# EAGLE design ModuleGliderScore (EAGLE 7.5.0)
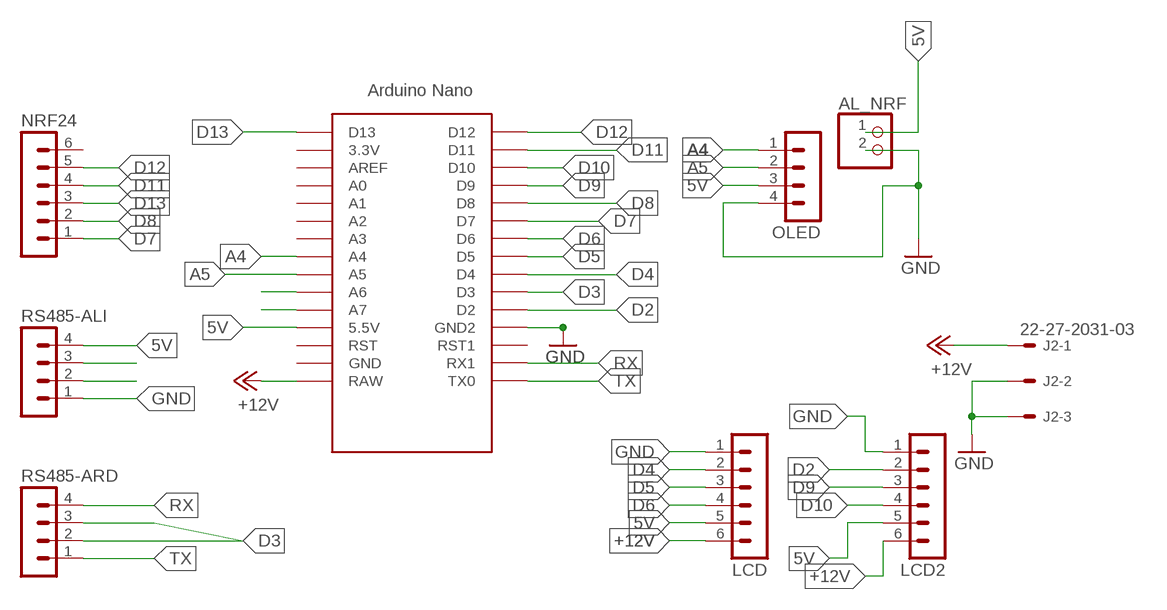
[diagram p0: schematic, sheet 1]

## Parts
AL_NRF  PINHD-1X2  [1X02]
J2  22-27-2031-03  [6410-03]
LCD  MA06-1  [MA06-1]
LCD2  MA06-1  [MA06-1]
NRF24  MA06-1  [MA06-1]
OLED  MA04-1  [MA04-1]
RS485-ALI  MA04-1  [MA04-1]
RS485-ARD  MA04-1  [MA04-1]
U$1  NANO  [NANO]

## Nets
5V: AL_NRF.1 LCD2.5 LCD.5 OLED.3 RS485-ALI.4 U$1.5V(5.5V)
+12V: J2.1 LCD2.6 LCD.6 U$1.RAW
A4: OLED.1 U$1.A4
A5: OLED.2 U$1.A5
A6-D: U$1.A6
A7-D: U$1.A7
D2: LCD2.2 U$1.D2
D3: RS485-ARD.2 RS485-ARD.3 U$1.D3
D4: LCD.2 U$1.D4
D5: LCD.3 U$1.D5
D6: LCD.4 U$1.D6
D7: NRF24.1 U$1.D7
D8: NRF24.2 U$1.D8
D9: LCD2.3 U$1.D9
D10: LCD2.4 U$1.D10
D11: NRF24.4 U$1.D11
D12: NRF24.5 U$1.D12
D13: NRF24.3 U$1.D13
GND: AL_NRF.2 J2.2 J2.3 LCD2.1 LCD.1 OLED.4 RS485-ALI.1 U$1.GND1(GND2)
N$8: RS485-ALI.2
N$9: RS485-ALI.3
RX: RS485-ARD.4 U$1.RX1
TX: RS485-ARD.1 U$1.TX0
Unconnected: NRF24.6 U$1.3.3V U$1.A0 U$1.A1 U$1.A2 U$1.A3 U$1.AREF U$1.GND U$1.ICSP1 U$1.ICSP2 U$1.ICSP3 U$1.ICSP4 U$1.ICSP5 U$1.ICSP6 U$1.RST U$1.RST1

## Library data of the parts
AL_NRF = pinhead:PINHD-1X2: PIN HEADER
J2 = con-molex:22-?-03: CONNECTOR wire to board 2.54 mm (.1 inch) pitch header; OC_FARNELL: unknown; OC_NEWARK: unknown
LCD LCD2 NRF24 = con-lstb:MA06-1: PIN HEADER; OC_FARNELL: unknown; OC_NEWARK: unknown
OLED RS485-ALI RS485-ARD = con-lstb:MA04-1: PIN HEADER; OC_FARNELL: unknown; OC_NEWARK: unknown
U$1 = Arduino-clone:NANO: Arduino Nano

## Board
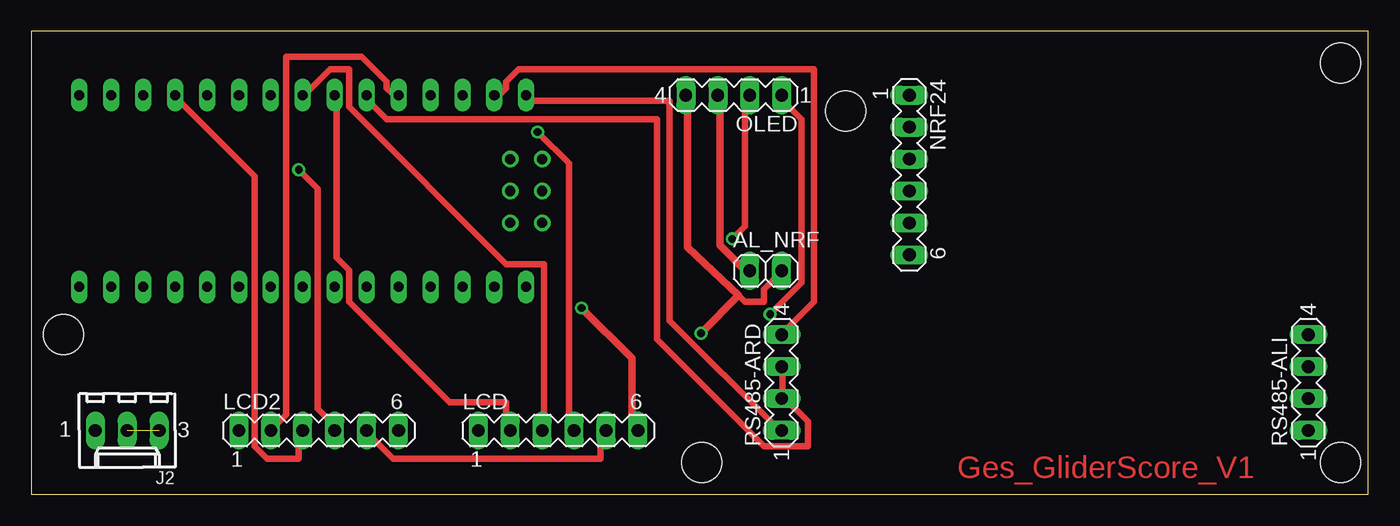
[diagram p1: board, top side]
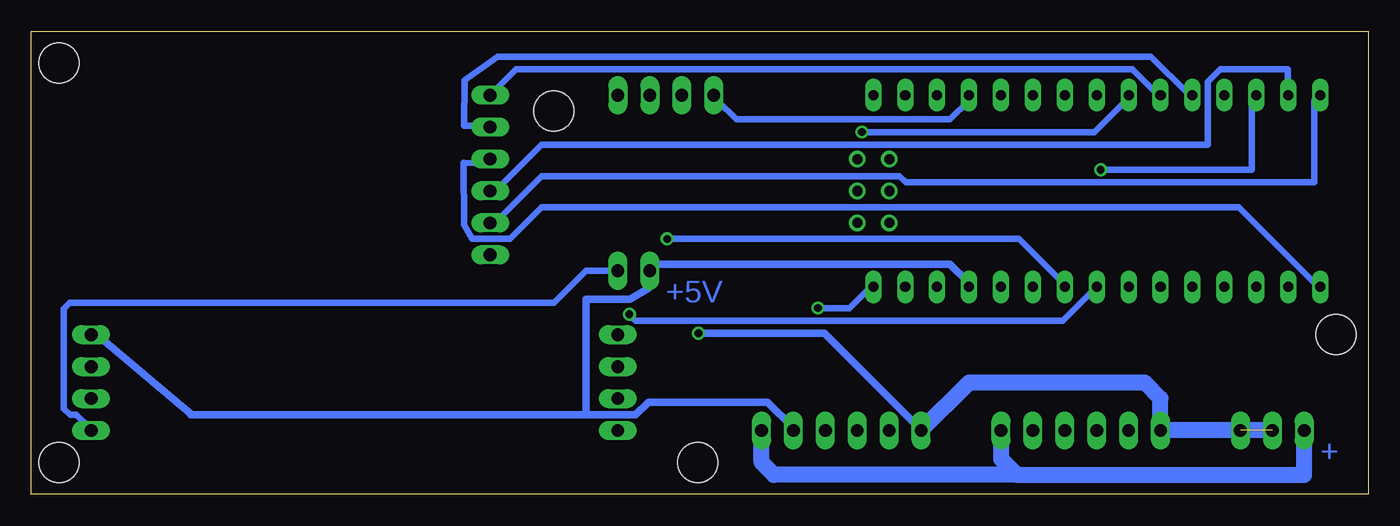
[diagram p2: board, bottom side, seen from below]

Size 106.35 x 36.82 mm. Coordinates in mm from the lower left corner, seen from the top.
Outline: 0,0 106.35,0 106.35,36.82 0,36.82 0,0
Copper layers (1*16): Top 0.035mm / dielectric 1.5mm / Bottom 0.035mm
Design rules "default *": minimum track width 20mil, minimum drill 24mil, track to track 8mil, track to pad 8mil, pad to pad 8mil, via to via 8mil, smd to smd 8mil, copper to edge 40mil, drill to drill 8mil, minimum pad ring 10mil, minimum via ring 8mil, stop-mask expansion 4mil, vias tented up to drill 0mil, thermal gap 10mil
Holes 3.2 mm at 104.14,34.29 104.14,2.54 2.54,12.7 53.34,2.54 64.77,30.48

### Footprints (pad centres in the part's own frame; a part is rotated, then mirrored left to right if it is on the bottom)
1X02 = drill 1.016 long: 1 -1.27,0; 2 1.27,0
6410-03 = drill 1.016 long: 1 2.54,0; 2 0,0; 3 -2.54,0
MA06-1 = drill 1.016 long: 1 -6.35,0; 2 -3.81,0; 3 -1.27,0; 4 1.27,0; 5 3.81,0; 6 6.35,0
MA04-1 = drill 1.016 long: 1 -3.81,0; 2 -1.27,0; 3 1.27,0; 4 3.81,0
NANO = drill 0.8 long: 3.3V -10.16,24.13; 5V -10.16,-1.27; A0 -10.16,19.05; A1 -10.16,16.51; A2 -10.16,13.97; A3 -10.16,11.43; A4 -10.16,8.89; A5 -10.16,6.35; A6 -10.16,3.81; A7 -10.16,1.27; AREF -10.16,21.59; D2 5.08,1.27; D3 5.08,3.81; D4 5.08,6.35; D5 5.08,8.89; D6 5.08,11.43; D7 5.08,13.97; D8 5.08,16.51; D9 5.08,19.05; D10 5.08,21.59; D11 5.08,24.13; D12 5.08,26.67; D13 -10.16,26.67; GND -10.16,-6.35; GND1 5.08,-1.27; RAW -10.16,-8.89; RST -10.16,-3.81; RST1 5.08,-3.81; RX1 5.08,-6.35; TX0 5.08,-8.89 | drill 0.8: ICSP1 -5.08,-10.16; ICSP2 -5.08,-7.62; ICSP3 -2.54,-10.16; ICSP4 -2.54,-7.62; ICSP5 0,-10.16; ICSP6 0,-7.62

### Placement (x,y rotation side)
AL_NRF  58.42,17.78 0 top
J2  7.62,5.08 180 top
LCD  41.91,5.08 0 top
LCD2  22.86,5.08 0 top
NRF24  69.85,25.4 270 top
OLED  55.88,31.75 180 top
RS485-ALI  101.6,8.89 90 top
RS485-ARD  59.69,8.89 90 top
U$1  30.48,26.67 90 top

### Tracks (layer width: path | path; a pad name or v marks a point on that pad's centre or on a via)
5V
  Top 0.508: LCD2.5 26.77,4.82 28.77,2.82 45.27,2.82 45.27,4.82 LCD.5 | 54.77,31.32 OLED.3 | 56.77,17.82 AL_NRF.1
  Top 0.61: 54.77,31.32 54.77,19.82 56.77,17.82
  Bottom 0.406: 93.69,6.32 93.69,6.43
  Bottom 0.508: 31.77,16.82 U$1.5V | 57.27,17.82 AL_NRF.1 | 101.27,12.82 RS485-ALI.4 | 45.77,5.32 LCD.5
  Bottom 0.61: 31.77,16.82 33.27,18.32 56.77,18.32 57.27,17.82 | 93.69,6.43 101.27,12.82 | AL_NRF.1 57.27,17.32 57.27,16.39 58.7,15.51 62.21,15.52 62.23,6.32 | 45.77,5.32 47.77,7.32 57.27,7.32 58.27,6.32 62.23,6.32 | 62.23,6.32 93.69,6.32
+12V  (via drill 0.61)
  Top 0.508: 47.77,5.32 LCD.6
  Top 0.61: v43.77,14.82 47.77,10.82 47.77,5.32
  Bottom 0.508: v43.77,14.82 41.27,14.82 39.77,16.32 U$1.RAW | 29.27,4.82 LCD2.6
  Bottom 1.27: 27.94,1.55 47.27,1.55 48.26,2.54 LCD.6 | LCD2.6 29.21,2.82 27.94,1.55 | J2.1 5.08,1.55 27.94,1.55
A4  (via drill 0.61)
  Top 0.508: v58.77,14.32 61.27,16.82 61.27,29.82 59.77,31.32 OLED.1
  Bottom 0.508: v58.77,14.32 58.27,13.82 24.27,13.82 21.77,16.32 U$1.A4
A5  (via drill 0.61)
  Top 0.508: v55.77,20.32 56.77,21.32 56.77,31.32 OLED.2
  Bottom 0.508: v55.77,20.32 27.77,20.32 24.27,16.82 U$1.A5
D2
  Top 0.508: U$1.D2 28.77,31.82 28.27,32.32 28.27,32.82 26.27,34.82 20.27,34.82 20.27,6.32 19.27,5.32 LCD2.2
D3
  Top 0.508: 59.77,7.82 61.77,5.82 61.77,3.82 58.27,3.82 49.77,12.32 49.77,29.82 28.27,29.82 26.77,31.32 U$1.D3 | 59.77,7.82 59.77,9.82 RS485-ARD.3 | 59.77,7.82 RS485-ARD.2
D4
  Top 0.508: U$1.D4 24.27,31.32 24.27,18.82 25.27,17.82 25.27,15.32 33.27,7.32 37.77,7.32 37.77,5.32 LCD.2
D5
  Top 0.508: U$1.D5 21.77,31.82 23.77,33.82 25.27,33.82 25.27,30.82 37.77,18.32 40.77,18.32 40.77,5.32 LCD.3
D6  (via drill 0.61)
  Top 0.508: v40.27,28.82 42.77,26.32 42.77,5.32 LCD.4
  Bottom 0.508: v40.27,28.82 21.77,28.82 19.27,31.32 U$1.D6
D7
  Bottom 0.508: U$1.D7 16.77,31.82 18.77,33.82 67.77,33.82 69.77,31.82 NRF24.1
D8
  Bottom 0.508: U$1.D8 14.27,31.82 17.27,34.82 69.27,34.82 71.9,32.95 71.94,29.32 70.27,29.32 NRF24.2
D9
  Top 0.508: U$1.D9 11.77,31.32 17.77,25.32 17.77,3.82 18.77,2.82 21.27,2.82 21.27,4.82 LCD2.3
D10  (via drill 0.61)
  Top 0.508: v21.27,25.82 22.77,24.32 22.77,6.82 23.77,5.82 23.77,5.32 LCD2.4
  Bottom 0.508: v21.27,25.82 9.27,25.82 9.27,31.32 U$1.D10
D11
  Bottom 0.508: U$1.D11 6.4,31.82 6.4,33.82 11.77,33.82 12.77,32.82 12.77,27.82 65.77,27.82 69.27,24.32 69.77,24.32 NRF24.4
D12
  Bottom 0.508: U$1.D12 4.27,31.32 4.27,24.82 36.77,24.82 37.27,25.32 65.77,25.32 69.27,21.82 69.77,21.82 NRF24.5
D13
  Bottom 0.508: U$1.D13 4.27,16.82 10.27,22.82 65.77,22.82 68.27,20.32 71.27,20.32 71.94,21.45 71.98,26.36 70.27,26.32 NRF24.3
GND  (via drill 0.61)  (1 unrouted)
  Top 0.508: 56.27,15.82 56.77,15.32 58.27,15.32 58.27,16.32 59.27,17.32 AL_NRF.2
  Top 0.61: v53.27,12.82 56.27,15.82 52.21,19.64 52.21,31.61 OLED.4
  Bottom 0.508: U$1.GND1 31.77,31.32 33.27,29.82 50.27,29.82 51.77,31.32 OLED.4 | RS485-ALI.1 101.77,5.32 102.77,6.32 103.27,6.32 103.77,6.82 103.77,14.78 103.31,15.24 64.77,15.24 62.23,17.78 AL_NRF.2 | 35.77,5.32 LCD.1
  Bottom 0.61: 35.77,5.32 43.27,12.82 v53.27,12.82
  Bottom 1.27: LCD.1 31.75,8.89 17.78,8.89 16.51,7.62 LCD2.1 J2.2
RX
  Top 0.508: U$1.RX1 37.27,31.82 37.77,32.32 37.77,32.82 38.77,33.82 62.27,33.82 62.27,15.32 59.77,12.82 RS485-ARD.4
TX
  Top 0.508: U$1.TX0 39.77,31.32 50.77,31.32 50.77,13.82 59.27,5.32 RS485-ARD.1

### Text on the board
Top: Ges_GliderScore_V1
Bottom: +5V | +